# EAGLE schematic tonguePWM (EAGLE 7.2.0)
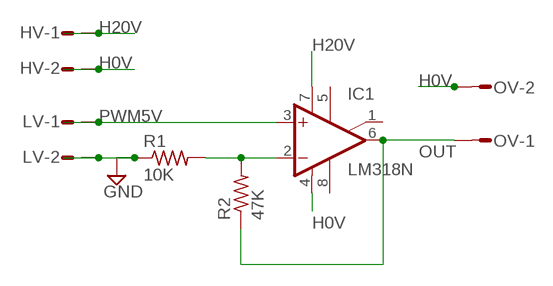
[diagram p0: schematic, sheet 1]

## Parts
HV  L02P  [L02P]
IC1  LM318N  [DIL08]
LV  L02P  [L02P]
OV  L02P  [L02P]
R1  10K  R-US_0204/5  [0204/5]
R2  47K  R-US_0204/5  [0204/5]

## Nets
GND: LV.2 R1.1
H0V: HV.2 IC1.4(V-) OV.2
H20V: HV.1 IC1.7(V+)
N$1: R1.2 R2.2
OUT: IC1.6(OUT) OV.1 R2.1
PWM5V: LV.1
Unconnected: IC1.1(ON/CMP) IC1.2(-IN) IC1.3(+IN) IC1.5(ON) IC1.8(CMP)

## Library data of the parts
HV LV OV = con-amp-mt:L02P: AMP MT CONNECTOR; OC_FARNELL: unknown; OC_NEWARK: unknown
IC1 = linear:LM318: OP AMP
R1 R2 = resistor:R-US_: RESISTOR, American symbol